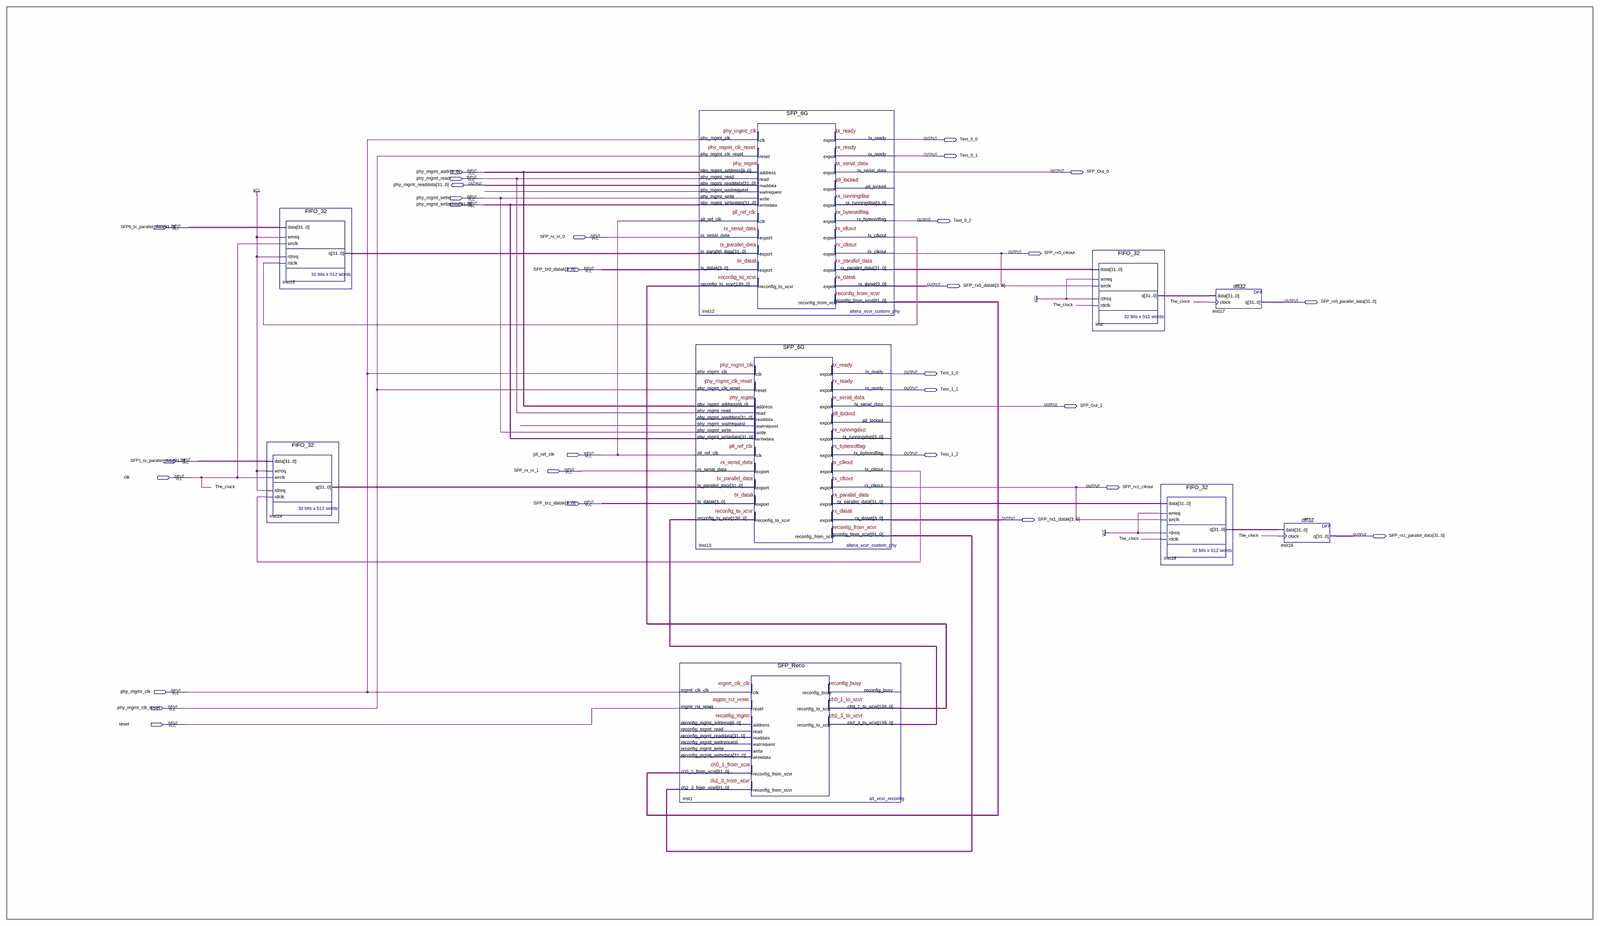
[diagram p0: schematic sheet, whole]
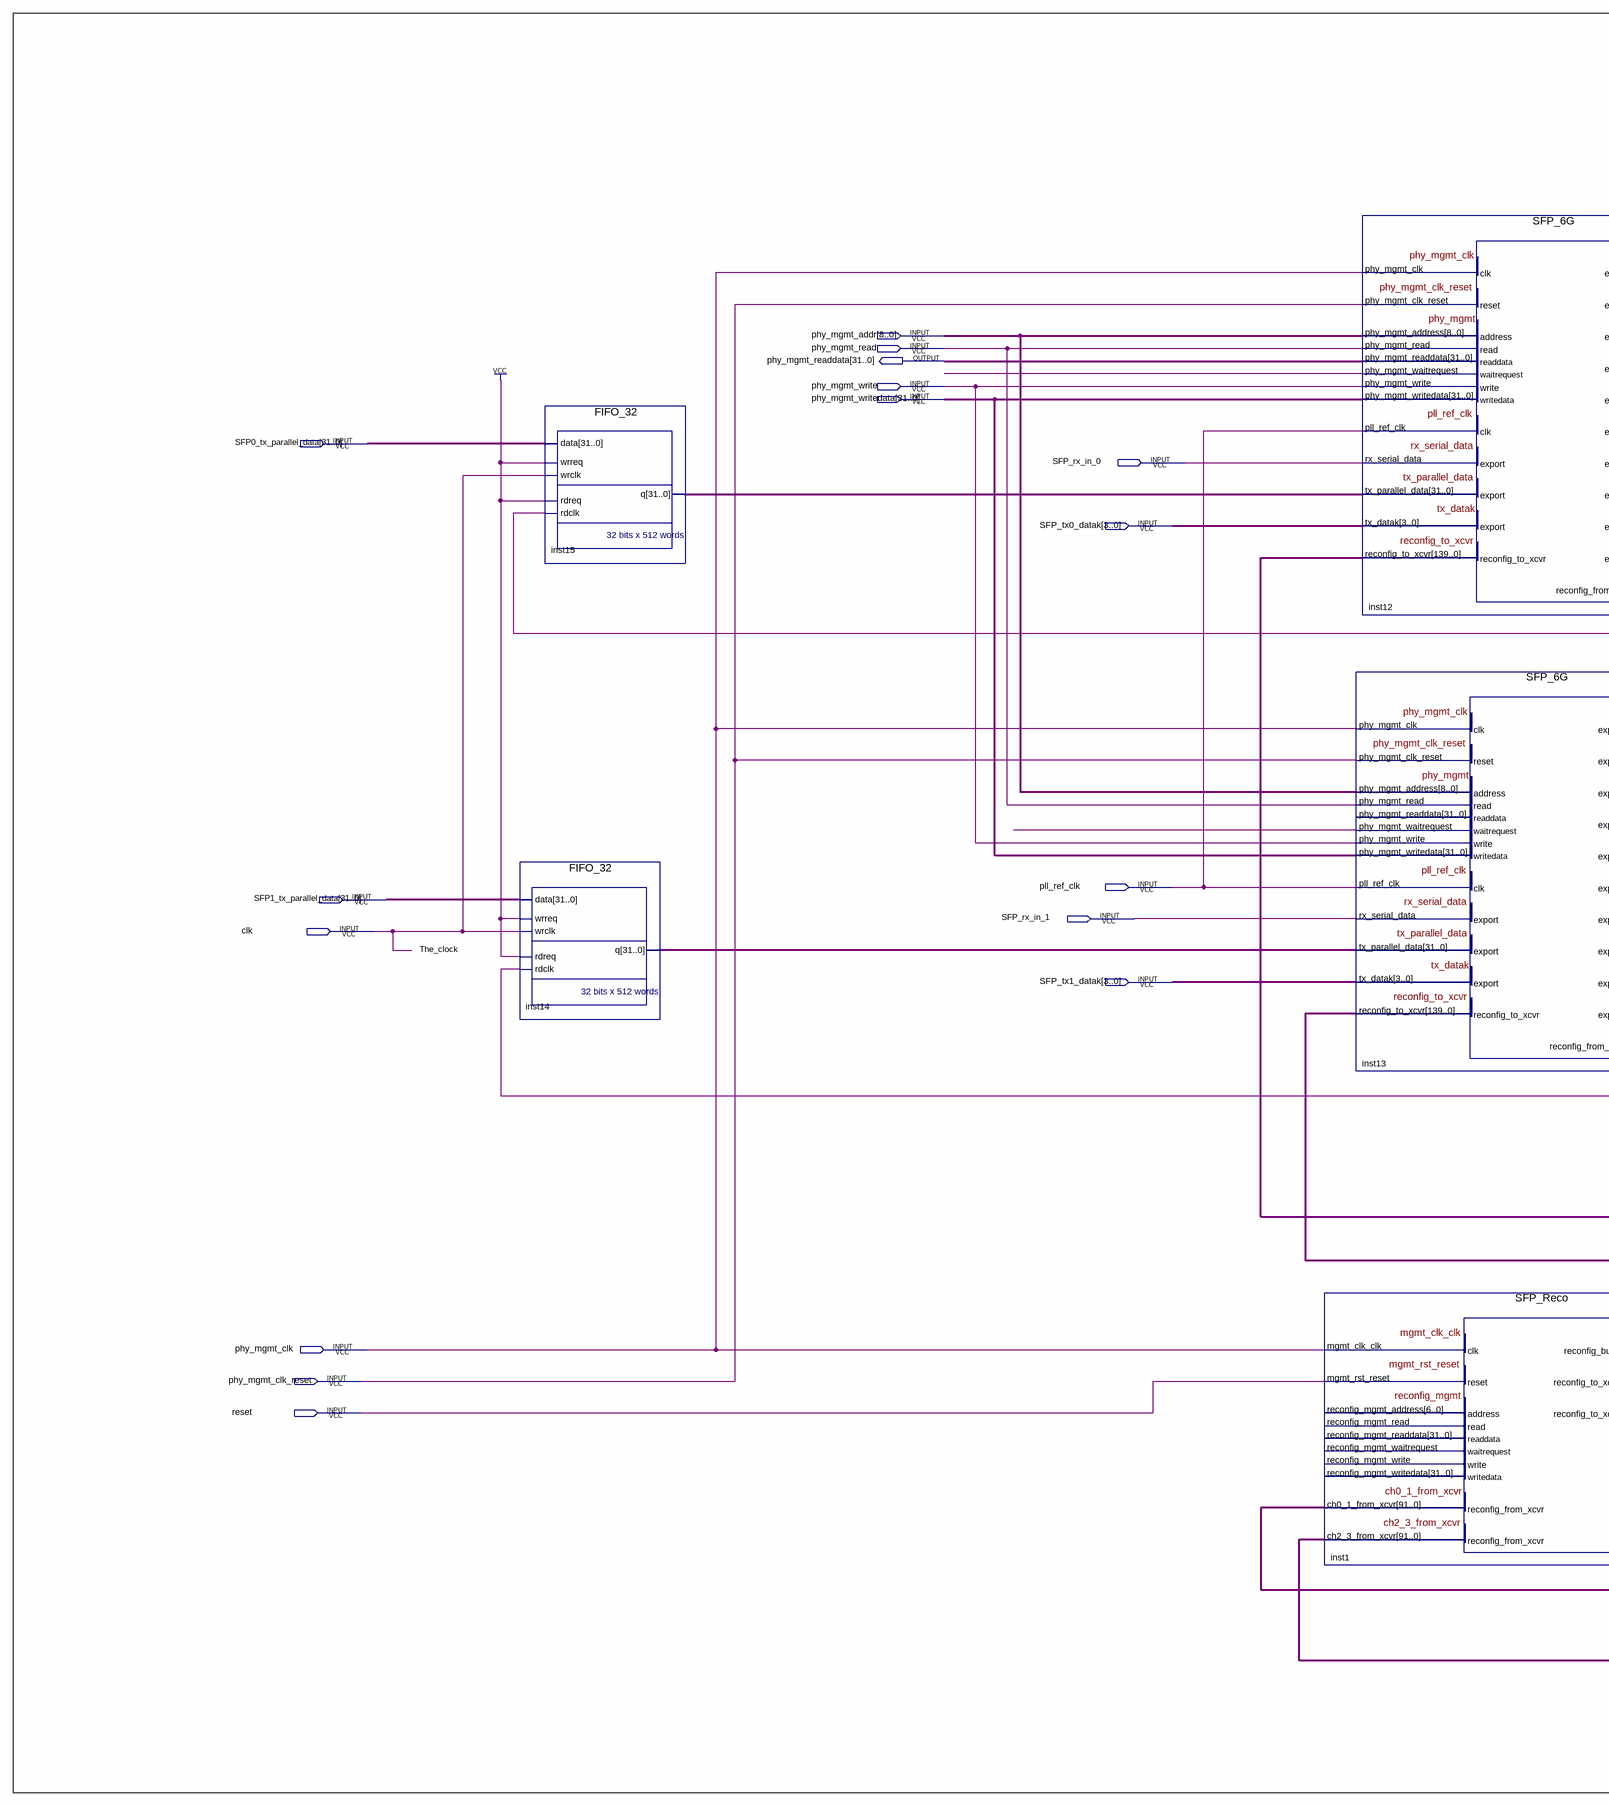
[diagram p1: schematic sheet, left part]
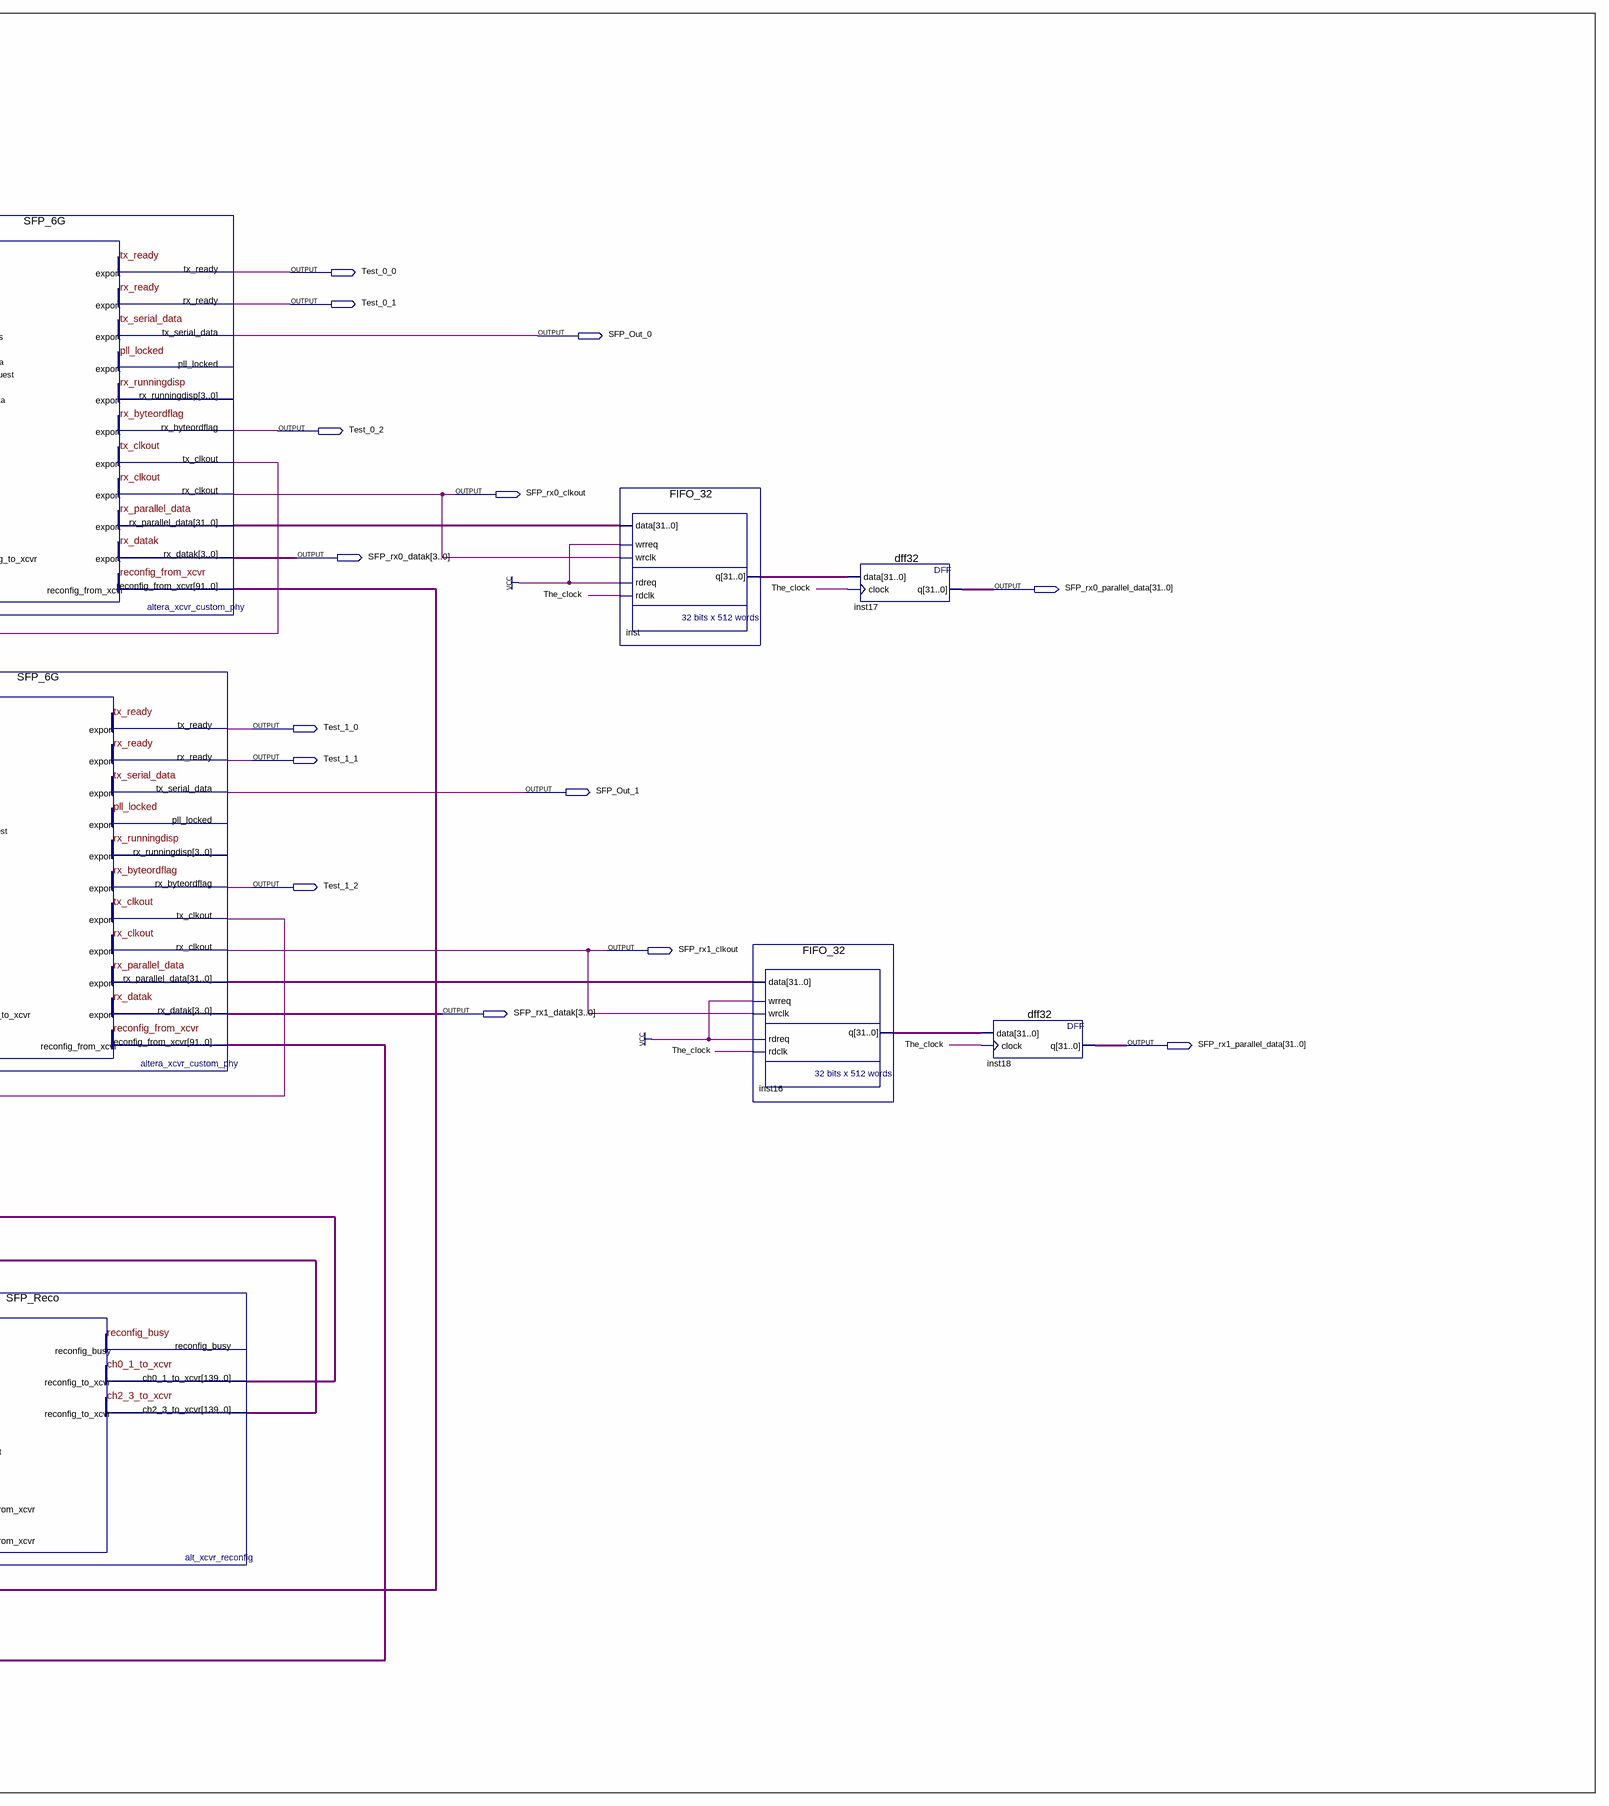
[diagram p2: schematic sheet, right part]
// Quartus schematic SFP_GxBlock_6G.bdf as structural Verilog: 9 symbols, 30 pins
module SFP_GxBlock_6G (
  input  [8:0] phy_mgmt_addr,
  input  phy_mgmt_read,
  input  phy_mgmt_write,
  input  [31:0] phy_mgmt_writedata,
  input  [31:0] SFP0_tx_parallel_data,
  input  SFP_rx_in_0,
  input  [3:0] SFP_tx0_datak,
  input  pll_ref_clk,
  input  [31:0] SFP1_tx_parallel_data,
  input  SFP_rx_in_1,
  input  clk,
  input  [3:0] SFP_tx1_datak,
  input  phy_mgmt_clk,
  input  phy_mgmt_clk_reset,
  input  reset,
  output Test_0_0,
  output Test_0_1,
  output SFP_Out_0,
  output [31:0] phy_mgmt_readdata,
  output Test_0_2,
  output SFP_rx0_clkout,
  output [3:0] SFP_rx0_datak,
  output [31:0] SFP_rx0_parallel_data,
  output Test_1_0,
  output Test_1_1,
  output SFP_Out_1,
  output Test_1_2,
  output SFP_rx1_clkout,
  output [3:0] SFP_rx1_datak,
  output [31:0] SFP_rx1_parallel_data
);

  wire inst12_phy_mgmt_waitrequest, inst12_tx_clkout, inst13_phy_mgmt_waitrequest, inst13_tx_clkout;
  wire [31:0] inst12_rx_parallel_data, inst13_rx_parallel_data, inst14_q, inst15_q, inst16_q, inst_q;
  wire [91:0] inst12_reconfig_from_xcvr, inst13_reconfig_from_xcvr;
  wire [139:0] inst1_ch0_1_to_xcvr, inst1_ch2_3_to_xcvr;

  FIFO_32 inst14 (
    .data(SFP1_tx_parallel_data), .wrreq(1'b1), .wrclk(clk), .rdreq(1'b1), .rdclk(inst13_tx_clkout),
    .q(inst14_q));
  FIFO_32 inst15 (
    .data(SFP0_tx_parallel_data), .wrreq(1'b1), .wrclk(clk), .rdreq(1'b1), .rdclk(inst12_tx_clkout),
    .q(inst15_q));
  SFP_Reco inst1 (
    .mgmt_clk_clk(phy_mgmt_clk), .mgmt_rst_reset(reset), .ch0_1_from_xcvr(inst12_reconfig_from_xcvr),
    .ch2_3_from_xcvr(inst13_reconfig_from_xcvr), .ch0_1_to_xcvr(inst1_ch0_1_to_xcvr),
    .ch2_3_to_xcvr(inst1_ch2_3_to_xcvr));  // open: reconfig_mgmt_address, reconfig_mgmt_read, reconfig_mgmt_write, reconfig_mgmt_writedata, reconfig_busy, reconfig_mgmt_readdata, reconfig_mgmt_waitrequest
  SFP_6G inst12 (
    .phy_mgmt_clk(phy_mgmt_clk), .phy_mgmt_clk_reset(phy_mgmt_clk_reset), .phy_mgmt_address(phy_mgmt_addr),
    .phy_mgmt_read(phy_mgmt_read), .phy_mgmt_write(phy_mgmt_write), .phy_mgmt_writedata(phy_mgmt_writedata),
    .pll_ref_clk(pll_ref_clk), .rx_serial_data(SFP_rx_in_0), .tx_parallel_data(inst15_q),
    .tx_datak(SFP_tx0_datak), .reconfig_to_xcvr(inst1_ch0_1_to_xcvr), .phy_mgmt_readdata(phy_mgmt_readdata),
    .phy_mgmt_waitrequest(inst12_phy_mgmt_waitrequest), .tx_ready(Test_0_0), .rx_ready(Test_0_1),
    .tx_serial_data(SFP_Out_0), .rx_byteordflag(Test_0_2), .tx_clkout(inst12_tx_clkout),
    .rx_clkout(SFP_rx0_clkout), .rx_parallel_data(inst12_rx_parallel_data), .rx_datak(SFP_rx0_datak),
    .reconfig_from_xcvr(inst12_reconfig_from_xcvr));  // open: pll_locked, rx_runningdisp
  SFP_6G inst13 (
    .phy_mgmt_clk(phy_mgmt_clk), .phy_mgmt_clk_reset(phy_mgmt_clk_reset), .phy_mgmt_address(phy_mgmt_addr),
    .phy_mgmt_read(phy_mgmt_read), .phy_mgmt_write(phy_mgmt_write), .phy_mgmt_writedata(phy_mgmt_writedata),
    .pll_ref_clk(pll_ref_clk), .rx_serial_data(SFP_rx_in_1), .tx_parallel_data(inst14_q),
    .tx_datak(SFP_tx1_datak), .reconfig_to_xcvr(inst1_ch2_3_to_xcvr),
    .phy_mgmt_waitrequest(inst13_phy_mgmt_waitrequest), .tx_ready(Test_1_0), .rx_ready(Test_1_1),
    .tx_serial_data(SFP_Out_1), .rx_byteordflag(Test_1_2), .tx_clkout(inst13_tx_clkout),
    .rx_clkout(SFP_rx1_clkout), .rx_parallel_data(inst13_rx_parallel_data), .rx_datak(SFP_rx1_datak),
    .reconfig_from_xcvr(inst13_reconfig_from_xcvr));  // open: phy_mgmt_readdata, pll_locked, rx_runningdisp
  FIFO_32 inst (
    .data(inst12_rx_parallel_data), .wrreq(1'b1), .wrclk(SFP_rx0_clkout), .rdreq(1'b1), .rdclk(clk),
    .q(inst_q));
  FIFO_32 inst16 (
    .data(inst13_rx_parallel_data), .wrreq(1'b1), .wrclk(SFP_rx1_clkout), .rdreq(1'b1), .rdclk(clk),
    .q(inst16_q));
  dff32 inst17 (.data(inst_q), .clock(clk), .q(SFP_rx0_parallel_data));
  dff32 inst18 (.data(inst16_q), .clock(clk), .q(SFP_rx1_parallel_data));

  // Other names for the same wires on the sheet: The_clock = clk
endmodule
